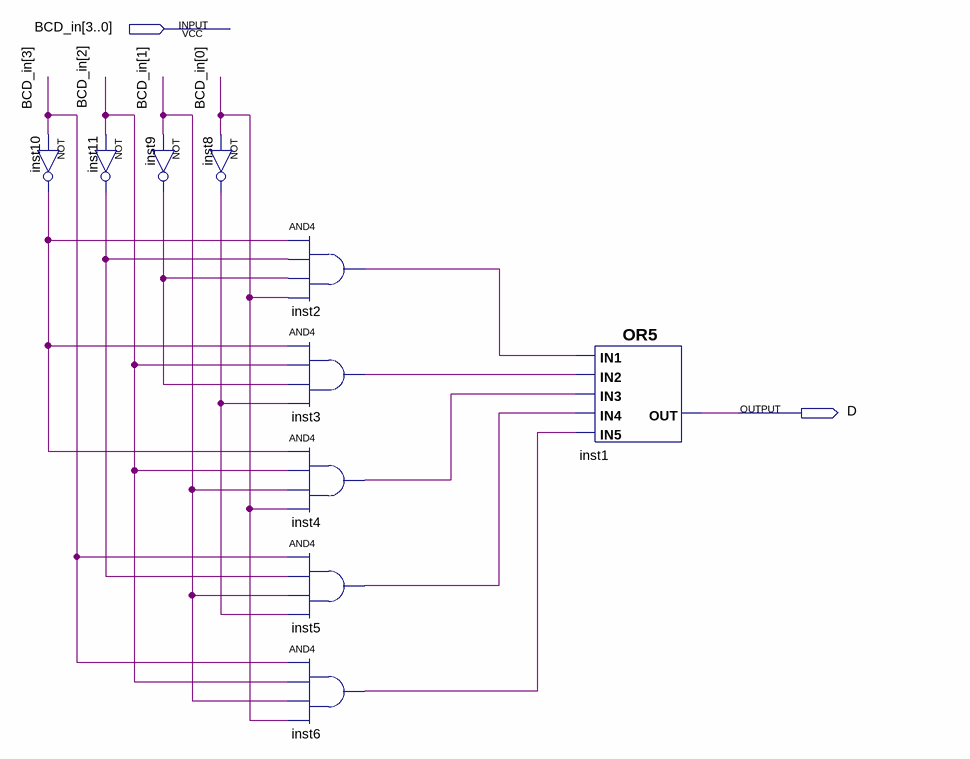
[diagram p0: schematic sheet]
// Quartus schematic BCD_D.bdf as structural Verilog: 10 symbols, 2 pins
module BCD_D (
  input  [3:0] BCD_in,
  output D
);

  wire inst2_out, inst3_out, inst4_out, inst5_out, inst6_out, inst8_out, inst9_out, inst10_out, inst11_out;

  not inst10 (inst10_out, BCD_in[3]);
  not inst9 (inst9_out, BCD_in[1]);
  not inst11 (inst11_out, BCD_in[2]);
  not inst8 (inst8_out, BCD_in[0]);
  and inst2 (inst2_out, inst10_out, inst11_out, inst9_out, BCD_in[0]);
  and inst3 (inst3_out, inst10_out, BCD_in[2], inst9_out, inst8_out);
  and inst4 (inst4_out, inst10_out, BCD_in[2], BCD_in[1], BCD_in[0]);
  and inst5 (inst5_out, BCD_in[3], inst11_out, BCD_in[1], inst8_out);
  and inst6 (inst6_out, BCD_in[3], BCD_in[2], BCD_in[1], BCD_in[0]);
  or inst1 (D, inst2_out, inst3_out, inst4_out, inst5_out, inst6_out);
endmodule
